# Altium project Automatic Plant Controller.PrjPcb
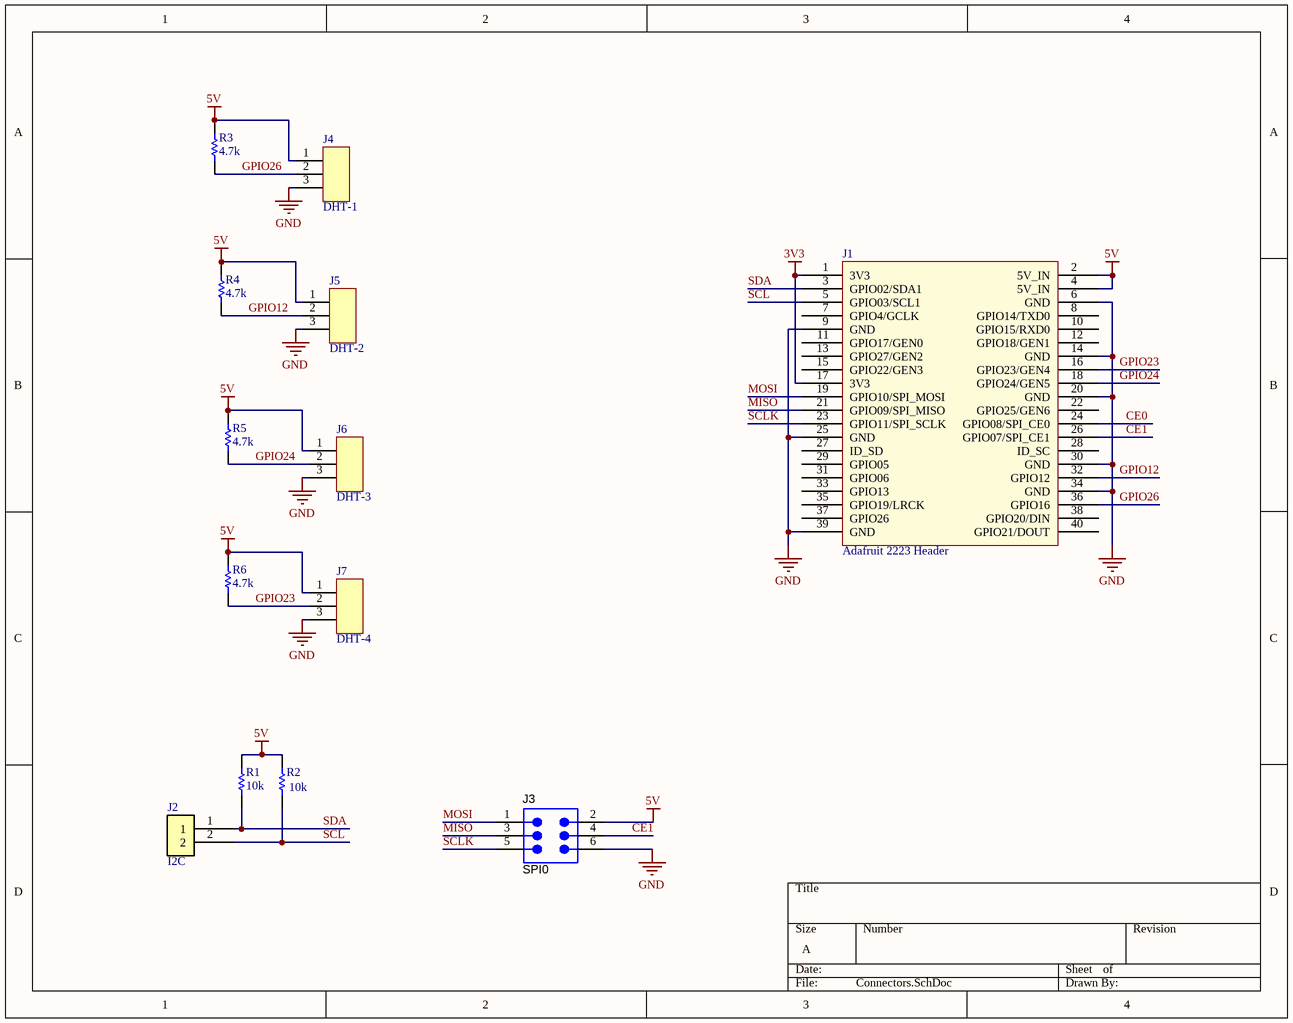
[diagram p0: Connectors.SchDoc]
2 sheets, 23 parts. Net scope: global (net labels, ports and power ports of the same name join across sheets).
Sheets:
  Connectors.SchDoc
  ADC.SchDoc

## Sheet Connectors.SchDoc
size A; DocumentNumber: 1; SheetNumber: 1; SheetTotal: 2

### Parts
J1  Adafruit 2223 Header  [PCB-dv9vmhrfa2chsb9gidwm-1]
J2  I2C  [PCB-t2j72m1yraok0w090vy8-1]
J3  SPI0  [PCB-195qa83xwzmdfln5hnix-1]
J4  DHT-1  [PCB-s0hfil65plaomi4ibvcw-1]
J5  DHT-2  [PCB-s0hfil65plaomi4ibvcw-1]
J6  DHT-3  [PCB-s0hfil65plaomi4ibvcw-1]
J7  DHT-4  [PCB-s0hfil65plaomi4ibvcw-1]
R1  10k  [PCB-urbe6pl2f36u5sj9z9e0-1]
R2  10k  [PCB-urbe6pl2f36u5sj9z9e0-1]
R3  4.7k  [PCB-etsube69rmkcafwxmreb-1]
R4  4.7k  [PCB-etsube69rmkcafwxmreb-1]
R5  4.7k  [PCB-etsube69rmkcafwxmreb-1]
R6  4.7k  [PCB-etsube69rmkcafwxmreb-1]

### Nets
3V3: J1.1(3V3) J1.17(3V3)
5V: J1.2(5V_IN) J1.4(5V_IN) J3.2 J4.1 J5.1 J6.1 J7.1 R1.2 R2.2 R3.2 R4.2 R5.2 R6.2
GND: J1.6(GND) J1.9(GND) J1.14(GND) J1.20(GND) J1.25(GND) J1.30(GND) J1.34(GND) J1.39(GND) J3.6 J4.3 J5.3 J6.3 J7.3
CE0: J1.24(GPIO08/SPI_CE0)
CE1: J1.26(GPIO07/SPI_CE1) J3.4
GPIO12: J1.32(GPIO12) J5.2 R4.1
GPIO23: J1.16(GPIO23/GEN4) J7.2 R6.1
GPIO24: J1.18(GPIO24/GEN5) J6.2 R5.1
GPIO26: J1.36(GPIO16) J4.2 R3.1
MISO: J1.21(GPIO09/SPI_MISO) J3.3
MOSI: J1.19(GPIO10/SPI_MOSI) J3.1
SCL: J1.5(GPIO03/SCL1) J2.2 R2.1
SCLK: J1.23(GPIO11/SPI_SCLK) J3.5
SDA: J1.3(GPIO02/SDA1) J2.1 R1.1

Not connected (* = marked no-connect by the designer): J1 7(GPIO4/GCLK) 8(GPIO14/TXD0) 10(GPIO15/RXD0) 11(GPIO17/GEN0) 12(GPIO18/GEN1) 13(GPIO27/GEN2) 15(GPIO22/GEN3) 22(GPIO25/GEN6) 27(ID_SD) 28(ID_SC) 29(GPIO05) 31(GPIO06) 33(GPIO13) 35(GPIO19/LRCK) 37(GPIO26) 38(GPIO20/DIN) 40(GPIO21/DOUT)

### Library data of the parts
J1 = CMP-4e918466a73d9156-23: GPIO Stacking Header for Pi A+/B+/Pi 2/Pi 3 - Extra-long 2x20 Pins
J2 = CMP-7939b1c60980a6fe-3: Board-To-Board Connector, Right Angle, WR-PHD Series, Through Hole, Header, 2, 2.54 mm; Manufacturer Part Number: 61300211021; Number of Contacts: 2; Gender: Male; RoHS: Compliant; Contact Material: Copper; Mounting Style: Through Hole; OctopartID: 7939b1c60980a6fe; Contact Plating: Gold; REACH SVHC Compliance: No SVHC; Octopart URL: http://octopart.com/61300211021-w%C3%BCrth+elektronik-32855519
J3 = CMP-3ebff6404e5de178-2: Board-To-Board Connector, WR-PHD Series, Surface Mount, Header, 6, 2.54 mm, Gold Plated Contacts; Manufacturer Part Number: 61000621121; Gender: Male; Number of Contacts: 6; OctopartID: 3ebff6404e5de178; Octopart URL: http://octopart.com/61000621121-w%C3%BCrth+elektronik-32855428; REACH SVHC Compliance: No SVHC; RoHS: Compliant; Contact Material: Copper; Mounting Style: Surface Mount, Vertical; Contact Plating: Gold
J4-J7 = CMP-8a90426ffa175557-32: THT Vertical Pin Header WR-PHD, Pitch 2.54 mm, Single Row, 3 pins; Manufacturer Part Number: 61300311121; Dielectric Withstanding Voltage: 500 V; Current Rating: 3.00 A; Number of Contacts: 3; Gender: Male; Contact Material: Copper; OctopartID: 8a90426ffa175557; Mounting Style: Through Hole; Operating Temperature: -40.0 °C (min); RoHS: Compliant; Packaging: Bag; REACH SVHC Compliance: No SVHC; Number of Pins: 3
R1 R2 = CMP-1974d512ef63c6b3-1: Res, AEC-Q200, Thick Film, 10K, 5%, 0603; Manufacturer Part Number: CRGCQ0603J10K; Packaging: Cut Tape (CT); Resistance Tolerance: ±5%; Lifecycle Status: Not Listed by Manufacturer; OctopartID: 1974d512ef63c6b3; Octopart URL: https://octopart.com/crgcq0603j10k-te+connectivity-91018097
R3-R6 = CMP-e8892324e857374e-1: Res Thin Film 0603 4.7K Ohm 1% 1/10W ±50ppm/°C Molded SMD SMD Paper T/R; Manufacturer Part Number: MCT06030C4701FP500; Power Rating: 125 mW; Case/Package (SI): 1608; Resistance: 4.70 kΩ; Voltage Rating (DC): 75.0 V; Lead-Free Status: Lead Free; Size-Length: 1.55 mm; Packaging: Cut Tape (CT); Size-Width: 850 µm; OctopartID: e8892324e857374e; RoHS: Compliant; Mounting Style: Surface Mount; Size-Height: 450 µm; Case/Package: 1608, 0603; Resistance Tolerance: ±1%

## Sheet ADC.SchDoc
size A; DocumentNumber: 2; SheetNumber: 2; SheetTotal: 2
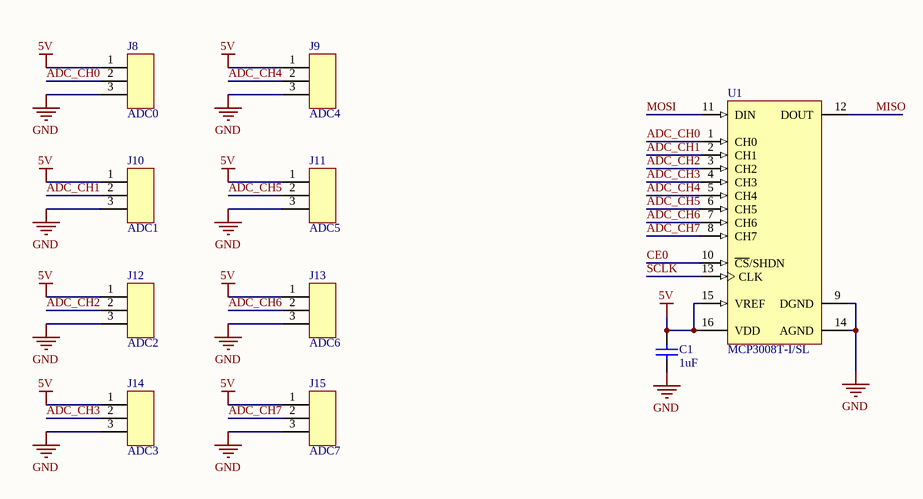
[diagram p1: ADC.SchDoc]

### Parts
C1  1uF  [C0805]
J8  ADC0  [PCB-s0hfil65plaomi4ibvcw-1]
J9  ADC4  [PCB-s0hfil65plaomi4ibvcw-1]
J10  ADC1  [PCB-s0hfil65plaomi4ibvcw-1]
J11  ADC5  [PCB-s0hfil65plaomi4ibvcw-1]
J12  ADC2  [PCB-s0hfil65plaomi4ibvcw-1]
J13  ADC6  [PCB-s0hfil65plaomi4ibvcw-1]
J14  ADC3  [PCB-s0hfil65plaomi4ibvcw-1]
J15  ADC7  [PCB-s0hfil65plaomi4ibvcw-1]
U1  MCP3008T-I/SL  [SOIC-SL16_L]

### Nets
5V: C1.1 J8.1 J9.1 J10.1 J11.1 J12.1 J13.1 J14.1 J15.1 U1.15(VREF) U1.16(VDD)
GND: C1.2 J8.3 J9.3 J10.3 J11.3 J12.3 J13.3 J14.3 J15.3 U1.9(DGND) U1.14(AGND)
ADC_CH0: J8.2 U1.1(CH0)
ADC_CH1: J10.2 U1.2(CH1)
ADC_CH2: J12.2 U1.3(CH2)
ADC_CH3: J14.2 U1.4(CH3)
ADC_CH4: J9.2 U1.5(CH4)
ADC_CH5: J11.2 U1.6(CH5)
ADC_CH6: J13.2 U1.7(CH6)
ADC_CH7: J15.2 U1.8(CH7)
CE0: U1.10(~{CS}/SHDN)
MISO: U1.12(DOUT)
MOSI: U1.11(DIN)
SCLK: U1.13(CLK)

### Library data of the parts
C1 = CMP-77c3bc4dc880a804-3: 0805 1 uF 25 V ±10 % Tolerance X7R SMT Multilayer Ceramic Capacitor; Manufacturer Part Number: CC0805KKX7R8BB105; Lead-Free Status: Lead Free; Voltage Rating (DC): 25.0 V; Capacitance Tolerance: ±10%; Octopart Url: http://octopart.com/cc0805kkx7r8bb105-yageo-42244645; Seller Landing  Url: https://octopart-clicks.com/click/track?country=US&ak=8157f166&sig=04b9cde&sid=5489&ppid=42244645&vpid=127579773&ct=offers; Number of Pins: 2; Mounting Style: Surface Mount; Packaging: Cut Tape (CT); Case/Package: 0805; REACH SVHC Compliance: No SVHC; RoHS: Compliant; Halogen Free Status: Halogen Free; Capacitance: 1uF; OctopartID: 77c3bc4dc880a804; Dielectric Characteristic: X7R
J8-J15 = CMP-8a90426ffa175557-32: as J4 on sheet Connectors; Contact Material: Copper; OctopartID: 8a90426ffa175557; Mounting Style: Through Hole; Operating Temperature: -40.0 °C (min); RoHS: Compliant; Packaging: Bag; REACH SVHC Compliance: No SVHC; Number of Pins: 3
U1 = CMP-1038587-6: 2.7V 4-Channel/8-Channel 10-Bit A/D Converters with SPI Serial Interface, 16-Pin SOIC 150mil, Industrial Temperature, Tape and Reel; Output Voltage: 4.1 V; Digital Logic Level: SAR; Number of Channels: 8; Number of Bits: 10; Supply Current: 0.000425 A; Lead-Free Status: Lead Free; Sample Rate: 200000.0 Hz; Number of Pins: 16; OctopartID: 6ffda6f17db7b03a; Mounting Style: Surface Mount; Case/Package: SOIC; Manufacturer Part Number: MCP3008T-I/SL; Lifecycle Status: Active; Octopart Url: https://octopart.com/mcp3008t-i%2Fsl-microchip-407340; RoHS: Compliant

## Nets that join several sheets
5V: Connectors (13 pins), ADC (11 pins)
GND: Connectors (13 pins), ADC (11 pins)
CE0: Connectors (J1.24), ADC (U1.10)
MISO: Connectors (J1.21 J3.3), ADC (U1.12)
MOSI: Connectors (J1.19 J3.1), ADC (U1.11)
SCLK: Connectors (J1.23 J3.5), ADC (U1.13)